# Altium schematic sheet MCU.SchDoc
size A4; SheetNumber: 4; SheetTotal: 4
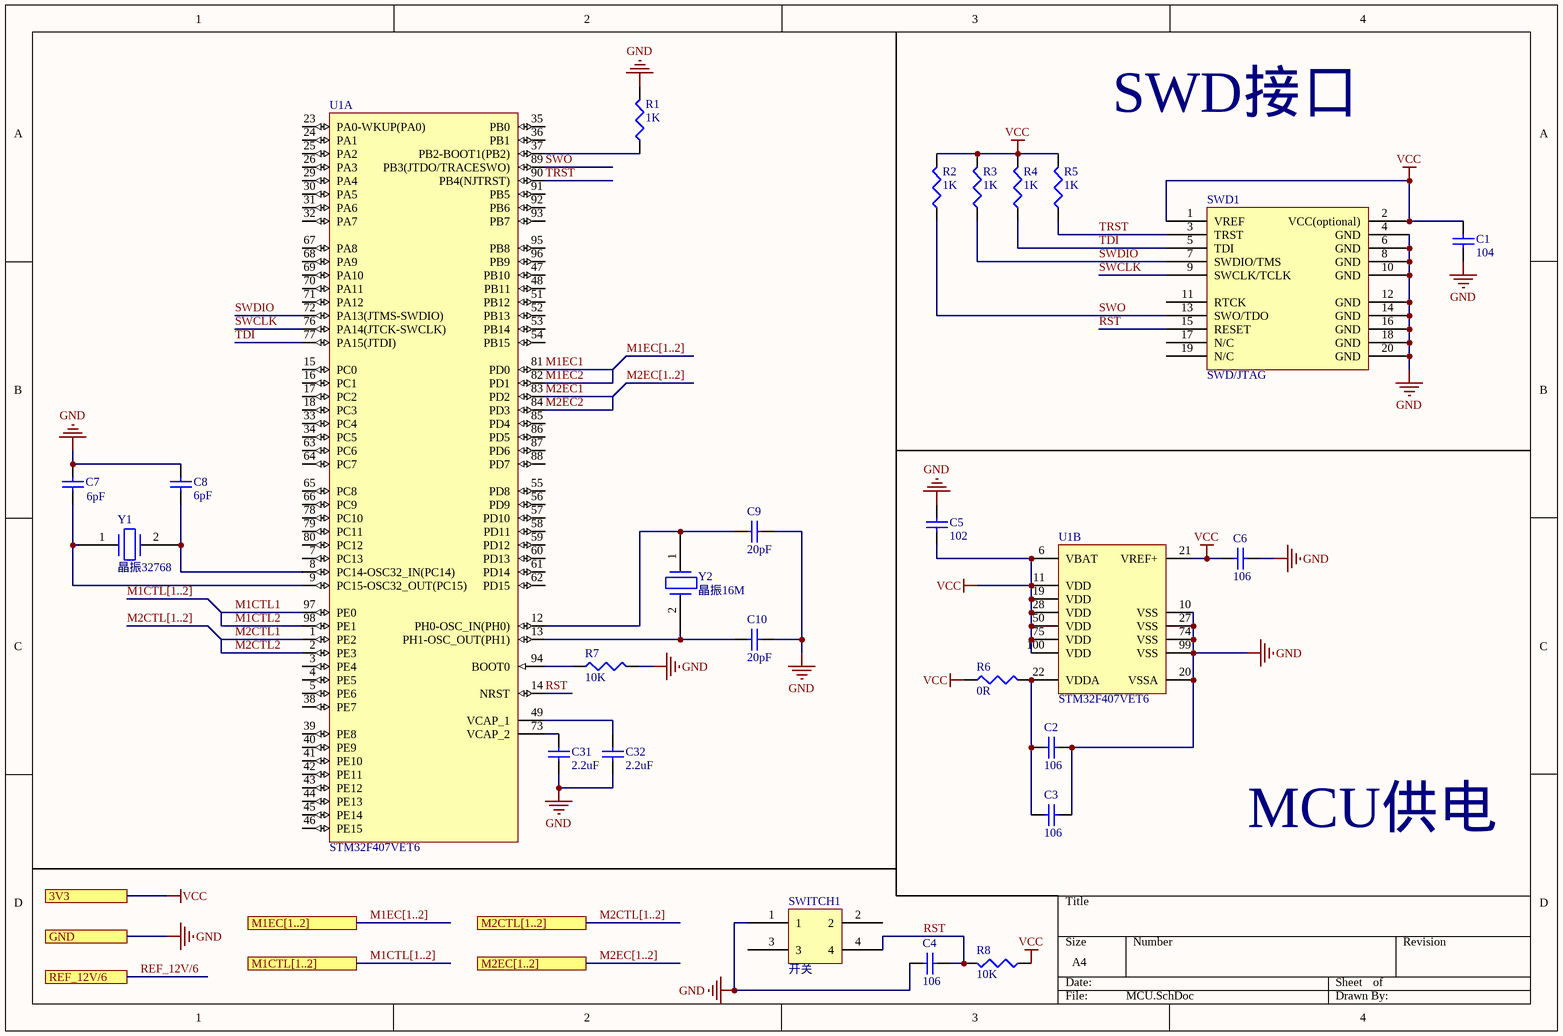
[diagram p0: MCU.SchDoc]

## Parts
C1  104  [MY0805]
C2  106  [MY0805]
C3  106  [MY0805]
C4  106  [MY0805]
C5  102  [MY0805]
C6  106  [MY0805]
C7  6pF  [MY0805]
C8  6pF  [MY0805]
C9  20pF  [MY0805]
C10  20pF  [MY0805]
C31  2.2uF  [MY0805]
C32  2.2uF  [MY0805]
R1  1K  [MY0805]
R2  1K  [MY0805]
R3  1K  [MY0805]
R4  1K  [MY0805]
R5  1K  [MY0805]
R6  0R  [MY0805]
R7  10K  [MY0805]
R8  10K  [MY0805]
SWD1  SWD/JTAG  [SWD]
SWITCH1  开关  [开关]
U1  STM32F407VET6  [STM-LQFP100_N]  (parts A,B of 2)
Y1  晶振32768  [晶振32768K_AT38]
Y2  晶振16M  [晶振16M]

## Ports
3V3, GND, M1CTL[1..2], M1EC[1..2], M2CTL[1..2], M2EC[1..2], REF_12V/6

## Nets
GND: C1.1 C2.2 C3.2 C4.1 C5.1 C6.2 C7.2 C8.2 C9.2 C10.2 C31.1 C32.1 R1.2 R7.2 SWD1.4(GND) SWD1.6(GND) SWD1.8(GND) SWD1.10(GND) SWD1.12(GND) SWD1.14(GND) SWD1.16(GND) SWD1.18(GND) SWD1.20(GND) SWITCH1.1 U1.10(VSS) U1.20(VSSA) U1.27(VSS) U1.74(VSS) U1.99(VSS) ; port GND
VCC: C1.2 C5.2 C6.1 R2.2 R3.2 R4.2 R5.2 R6.1 R8.1 SWD1.1(VREF) SWD1.2(VCC(optional)) U1.6(VBAT) U1.11(VDD) U1.19(VDD) U1.21(VREF+) U1.28(VDD) U1.50(VDD) U1.75(VDD) U1.100(VDD) ; port 3V3
M1CTL1: U1.97(PE0)
M1CTL2: U1.98(PE1)
M1EC1: U1.81(PD0)
M1EC2: U1.82(PD1)
M2CTL1: U1.1(PE2)
M2CTL2: U1.2(PE3)
M2EC1: U1.83(PD2)
M2EC2: U1.84(PD3)
REF_12V/6: port REF_12V/6
RST: C4.2 R8.2 SWD1.15(RESET) SWITCH1.4 U1.14(NRST)
SWCLK: SWD1.9(SWCLK/TCLK) U1.76(PA14(JTCK-SWCLK))
SWDIO: R3.1 SWD1.7(SWDIO/TMS) U1.72(PA13(JTMS-SWDIO))
SWO: R2.1 SWD1.13(SWO/TDO) U1.89(PB3(JTDO/TRACESWO))
TDI: R4.1 SWD1.5(TDI) U1.77(PA15(JTDI))
TRST: R5.1 SWD1.3(TRST) U1.90(PB4(NJTRST))
NetC2_1: C2.1 C3.1 R6.2 U1.22(VDDA)
NetC7_1: C7.1 U1.9(PC15-OSC32_OUT(PC15)) Y1.1
NetC8_1: C8.1 U1.8(PC14-OSC32_IN(PC14)) Y1.2
NetC9_1: C9.1 U1.12(PH0-OSC_IN(PH0)) Y2.1
NetC10_1: C10.1 U1.13(PH1-OSC_OUT(PH1)) Y2.2
NetC31_2: C31.2 U1.73(VCAP_2)
NetC32_2: C32.2 U1.49(VCAP_1)
NetR1_1: R1.1 U1.37(PB2-BOOT1(PB2))
NetR7_1: R7.1 U1.94(BOOT0)

Not connected (* = marked no-connect by the designer): SWD1 11(RTCK) 17(N/C) 19(N/C); SWITCH1 2 3; U1 3(PE4) 4(PE5) 5(PE6) 7(PC13) 15(PC0) 16(PC1) 17(PC2) 18(PC3) 23(PA0-WKUP(PA0)) 24(PA1) 25(PA2) 26(PA3) 29(PA4) 30(PA5) 31(PA6) 32(PA7) 33(PC4) 34(PC5) 35(PB0) 36(PB1) 38(PE7) 39(PE8) 40(PE9) 41(PE10) 42(PE11) 43(PE12) 44(PE13) 45(PE14) 46(PE15) 47(PB10) 48(PB11) 51(PB12) 52(PB13) 53(PB14) 54(PB15) 55(PD8) 56(PD9) 57(PD10) 58(PD11) 59(PD12) 60(PD13) 61(PD14) 62(PD15) 63(PC6) 64(PC7) 65(PC8) 66(PC9) 67(PA8) 68(PA9) 69(PA10) 70(PA11) 71(PA12) 78(PC10) 79(PC11) 80(PC12) 85(PD4) 86(PD5) 87(PD6) 88(PD7) 91(PB5) 92(PB6) 93(PB7) 95(PB8) 96(PB9)

## Buses and harness runs
bus M1CTL[1..2]
bus M1CTL[1..2] = port M1CTL[1..2]
bus M1EC[1..2]
bus M1EC[1..2] = port M1EC[1..2]
bus M2CTL[1..2]
bus M2CTL[1..2] = port M2CTL[1..2]
bus M2EC[1..2]
bus M2EC[1..2] = port M2EC[1..2]

## Notes on the sheet
- SWD接口
- MCU供电

## Library data of the parts
C1-C6 C9 C10 C31 C32 = Cap: Capacitor; Published: 8-Jun-2000; LatestRevisionDate: 17-Jul-2002; LatestRevisionNote: Re-released for DXP Platform.; PackageReference: RAD-0.3; Publisher: Altium Limited; PackageDescription: Radial Cap, Thru-Hole; 2 Leads; 0.3 in Pin Spacing
  C1: Value: 104
  C2-C4 C6: Value: 106
  C5: Value: 102
  C9 C10: Value: 20PF
  C31 C32: Value: 2.2uF
C7 C8 = Cap: Capacitor; Value: 20PF; Published: 8-Jun-2000; LatestRevisionDate: 17-Jul-2002; LatestRevisionNote: Re-released for DXP Platform.; PackageReference: RAD-0.3; Publisher: Altium Limited; PackageDescription: Radial Cap, Thru-Hole; 2 Leads; 0.3 in Pin Spacing
R1-R8 = Res3: Resistor; Published: 8-Jun-2000; LatestRevisionDate: 29-May-2009; LatestRevisionNote: IPC-7351 Footprint Added.; PackageReference: J1-0603; Publisher: Altium Limited; PackageDescription: Chip Resistor
  R1-R5: Value: 1K
  R6: Value: 0R
  R7 R8: Value: 10K
U1 = STM32F407VET6: ARM Cortex-M4 32-bit MCU+FPU, 210 DMIPS, 512 kB Flash, 192 kB Internal RAM, 82 I/Os, 100-pin LQFP, -40 to 85 degC, Tray; Manufacturer: STMicroelectronics; D/A Converter: 2x12-bit; FLASH Size (Prog) (kB): 512; I/Os (High Current): 82; Internal RAM Size (kB): 192; Operating Frequency(F) (Processor speed) (MHz): 168; Supply Voltage(Vcc) max (V): 3.6; Supply Voltage(Vcc) min (V): 1.8; DatasheetVersion: Rev. 4; PackageVersion: Rev. 1, 06/2013; PackageReference: LQFP100; PackageDescription: 100-Pin Low Profile Quad Flat Package, 14 x 14 mm Body, 0.5 mm Pitch; Supplier 1: Digi-Key; Supplier Part Number 1: 497-12075-ND; Supplier 2: Farnell; Supplier Part Number 2: 2064367; Supplier 3: Newark; Supplier Part Number 3: 73T2332; Supplier 4: Mouser; Supplier Part Number 4: 511-STM32F407VET6; Core: ARM Cortex-M4; Packing: Tray; Mounting Technology: Surface Mount; PartNumber: STM32F407VET6; ComponentLink1Description: Manufacturer URL; ComponentLink1URL: http://www.st.com/web/en/home.html; ComponentLink2Description: Datasheet; ComponentLink2URL: http://www.st.com/st-web-ui/static/active/en/resource/technical/document/datasheet/DM00037051.pdf; ComponentLink3Description: Package Specification; ComponentLink3URL: http://www.st.com/st-web-ui/static/active/en/resource/technical/document/data_brief/DM00071938.pdf
Y1 Y2 = 晶振